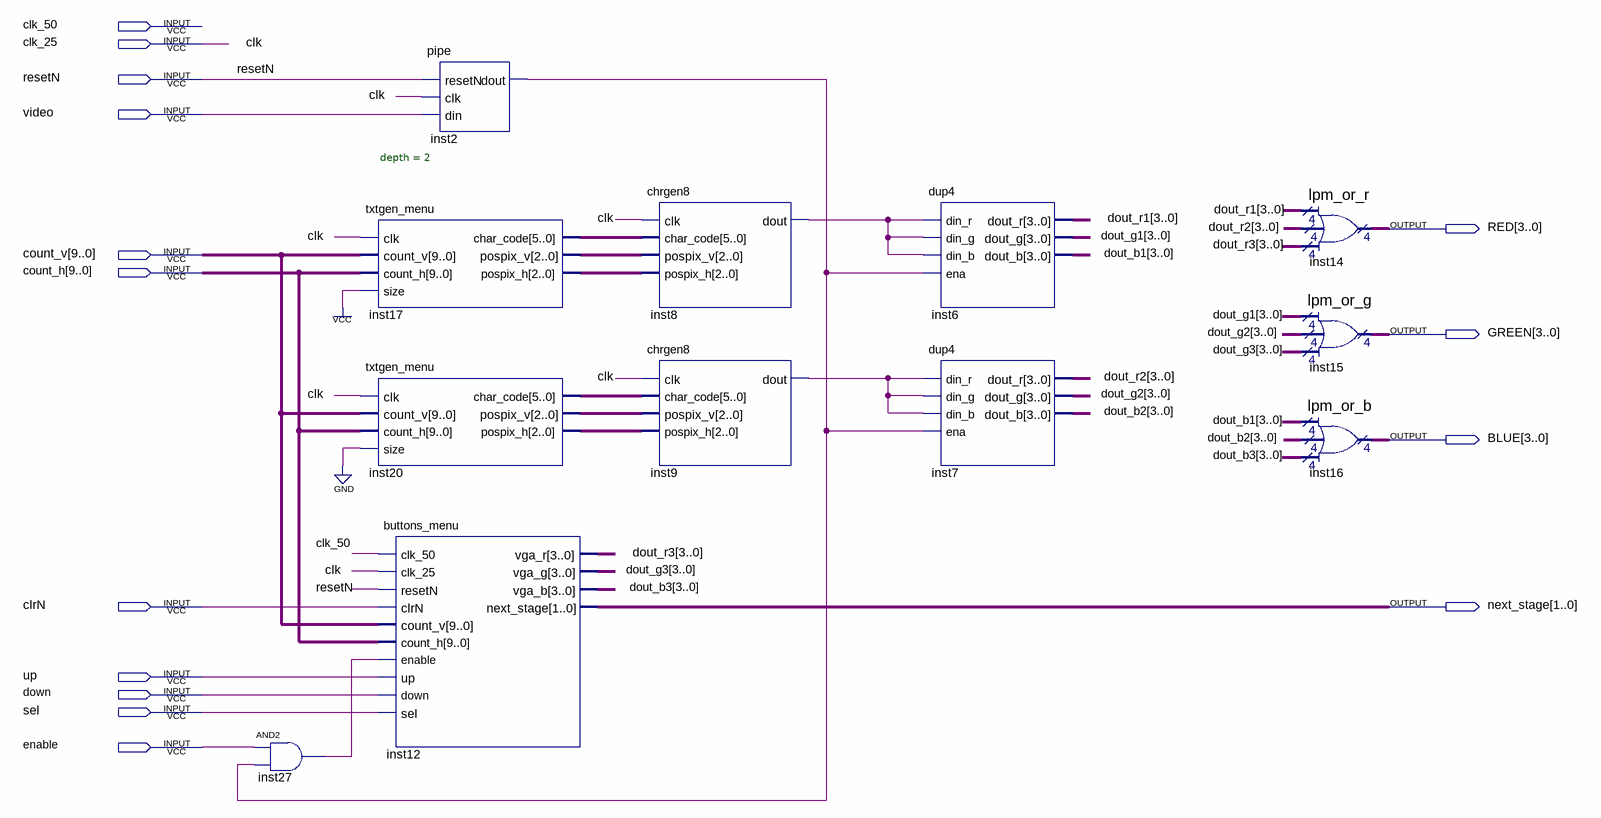
[diagram p0: schematic sheet]
// Quartus schematic screen_menu.bdf as structural Verilog: 12 symbols, 15 pins
module screen_menu (
  input  clk_50,
  input  clk_25,
  input  resetN,
  input  video,
  input  [9:0] count_v,
  input  [9:0] count_h,
  input  clrN,
  input  up,
  input  down,
  input  sel,
  input  enable,
  output [3:0] RED,
  output [3:0] GREEN,
  output [3:0] BLUE,
  output [1:0] next_stage
);

  wire inst2_dout, inst8_dout, inst9_dout, inst27_out;
  wire [2:0] inst17_pospix_h, inst17_pospix_v, inst20_pospix_h, inst20_pospix_v;
  wire [3:0] dout_b1, dout_b2, dout_b3, dout_g1, dout_g2, dout_g3, dout_r1, dout_r2, dout_r3;
  wire [5:0] inst17_char_code, inst20_char_code;

  and inst27 (inst27_out, enable, inst2_dout);
  txtgen_menu inst17 (
    .clk(clk_25), .count_v(count_v), .count_h(count_h), .size(1'b1), .char_code(inst17_char_code),
    .pospix_v(inst17_pospix_v), .pospix_h(inst17_pospix_h));
  txtgen_menu inst20 (
    .clk(clk_25), .count_v(count_v), .count_h(count_h), .size(1'b0), .char_code(inst20_char_code),
    .pospix_v(inst20_pospix_v), .pospix_h(inst20_pospix_h));
  buttons_menu inst12 (
    .clk_50(clk_50), .clk_25(clk_25), .resetN(resetN), .clrN(clrN), .count_v(count_v), .count_h(count_h),
    .enable(inst27_out), .up(up), .down(down), .sel(sel), .vga_r(dout_r3), .vga_g(dout_g3), .vga_b(dout_b3),
    .next_stage(next_stage));
  pipe #(.depth(2)) inst2 (.resetN(resetN), .clk(clk_25), .din(video), .dout(inst2_dout));
  chrgen8 inst8 (
    .clk(clk_25), .char_code(inst17_char_code), .pospix_v(inst17_pospix_v), .pospix_h(inst17_pospix_h),
    .dout(inst8_dout));
  chrgen8 inst9 (
    .clk(clk_25), .char_code(inst20_char_code), .pospix_v(inst20_pospix_v), .pospix_h(inst20_pospix_h),
    .dout(inst9_dout));
  dup4 inst6 (
    .din_r(inst8_dout), .din_g(inst8_dout), .din_b(inst8_dout), .ena(inst2_dout), .dout_r(dout_r1),
    .dout_g(dout_g1), .dout_b(dout_b1));
  dup4 inst7 (
    .din_r(inst9_dout), .din_g(inst9_dout), .din_b(inst9_dout), .ena(inst2_dout), .dout_r(dout_r2),
    .dout_g(dout_g2), .dout_b(dout_b2));
  lpm_or_r inst14 (.data0x(dout_r1), .data1x(dout_r2), .data2x(dout_r3), .result(RED));
  lpm_or_g inst15 (.data0x(dout_g1), .data1x(dout_g2), .data2x(dout_g3), .result(GREEN));
  lpm_or_b inst16 (.data0x(dout_b1), .data1x(dout_b2), .data2x(dout_b3), .result(BLUE));

  // Other names for the same wires on the sheet: clk = clk_25
endmodule
